# Altium schematic sheet MainBoard.SchDoc: Epic Plus
size C; Author: Thomas Schmid; CompanyName: UCLA NESL; PageSetup: Record=PageOptions|CenterHorizontal=True|CenterVertical=True|PrintScale=1.40|XCorrection=1.00|YCorrection=1.00|PrintKind=1|BorderSize=5000000|LeftOffset=0|BottomOffset=0|Orientation=2|PaperLength=5588|PaperWidth=4318|Scale=100|PaperSource=7|PrintQuality=-4|MediaType=1|DitherType=10|PaperKind=ANSI C|PrintScaleMode=1
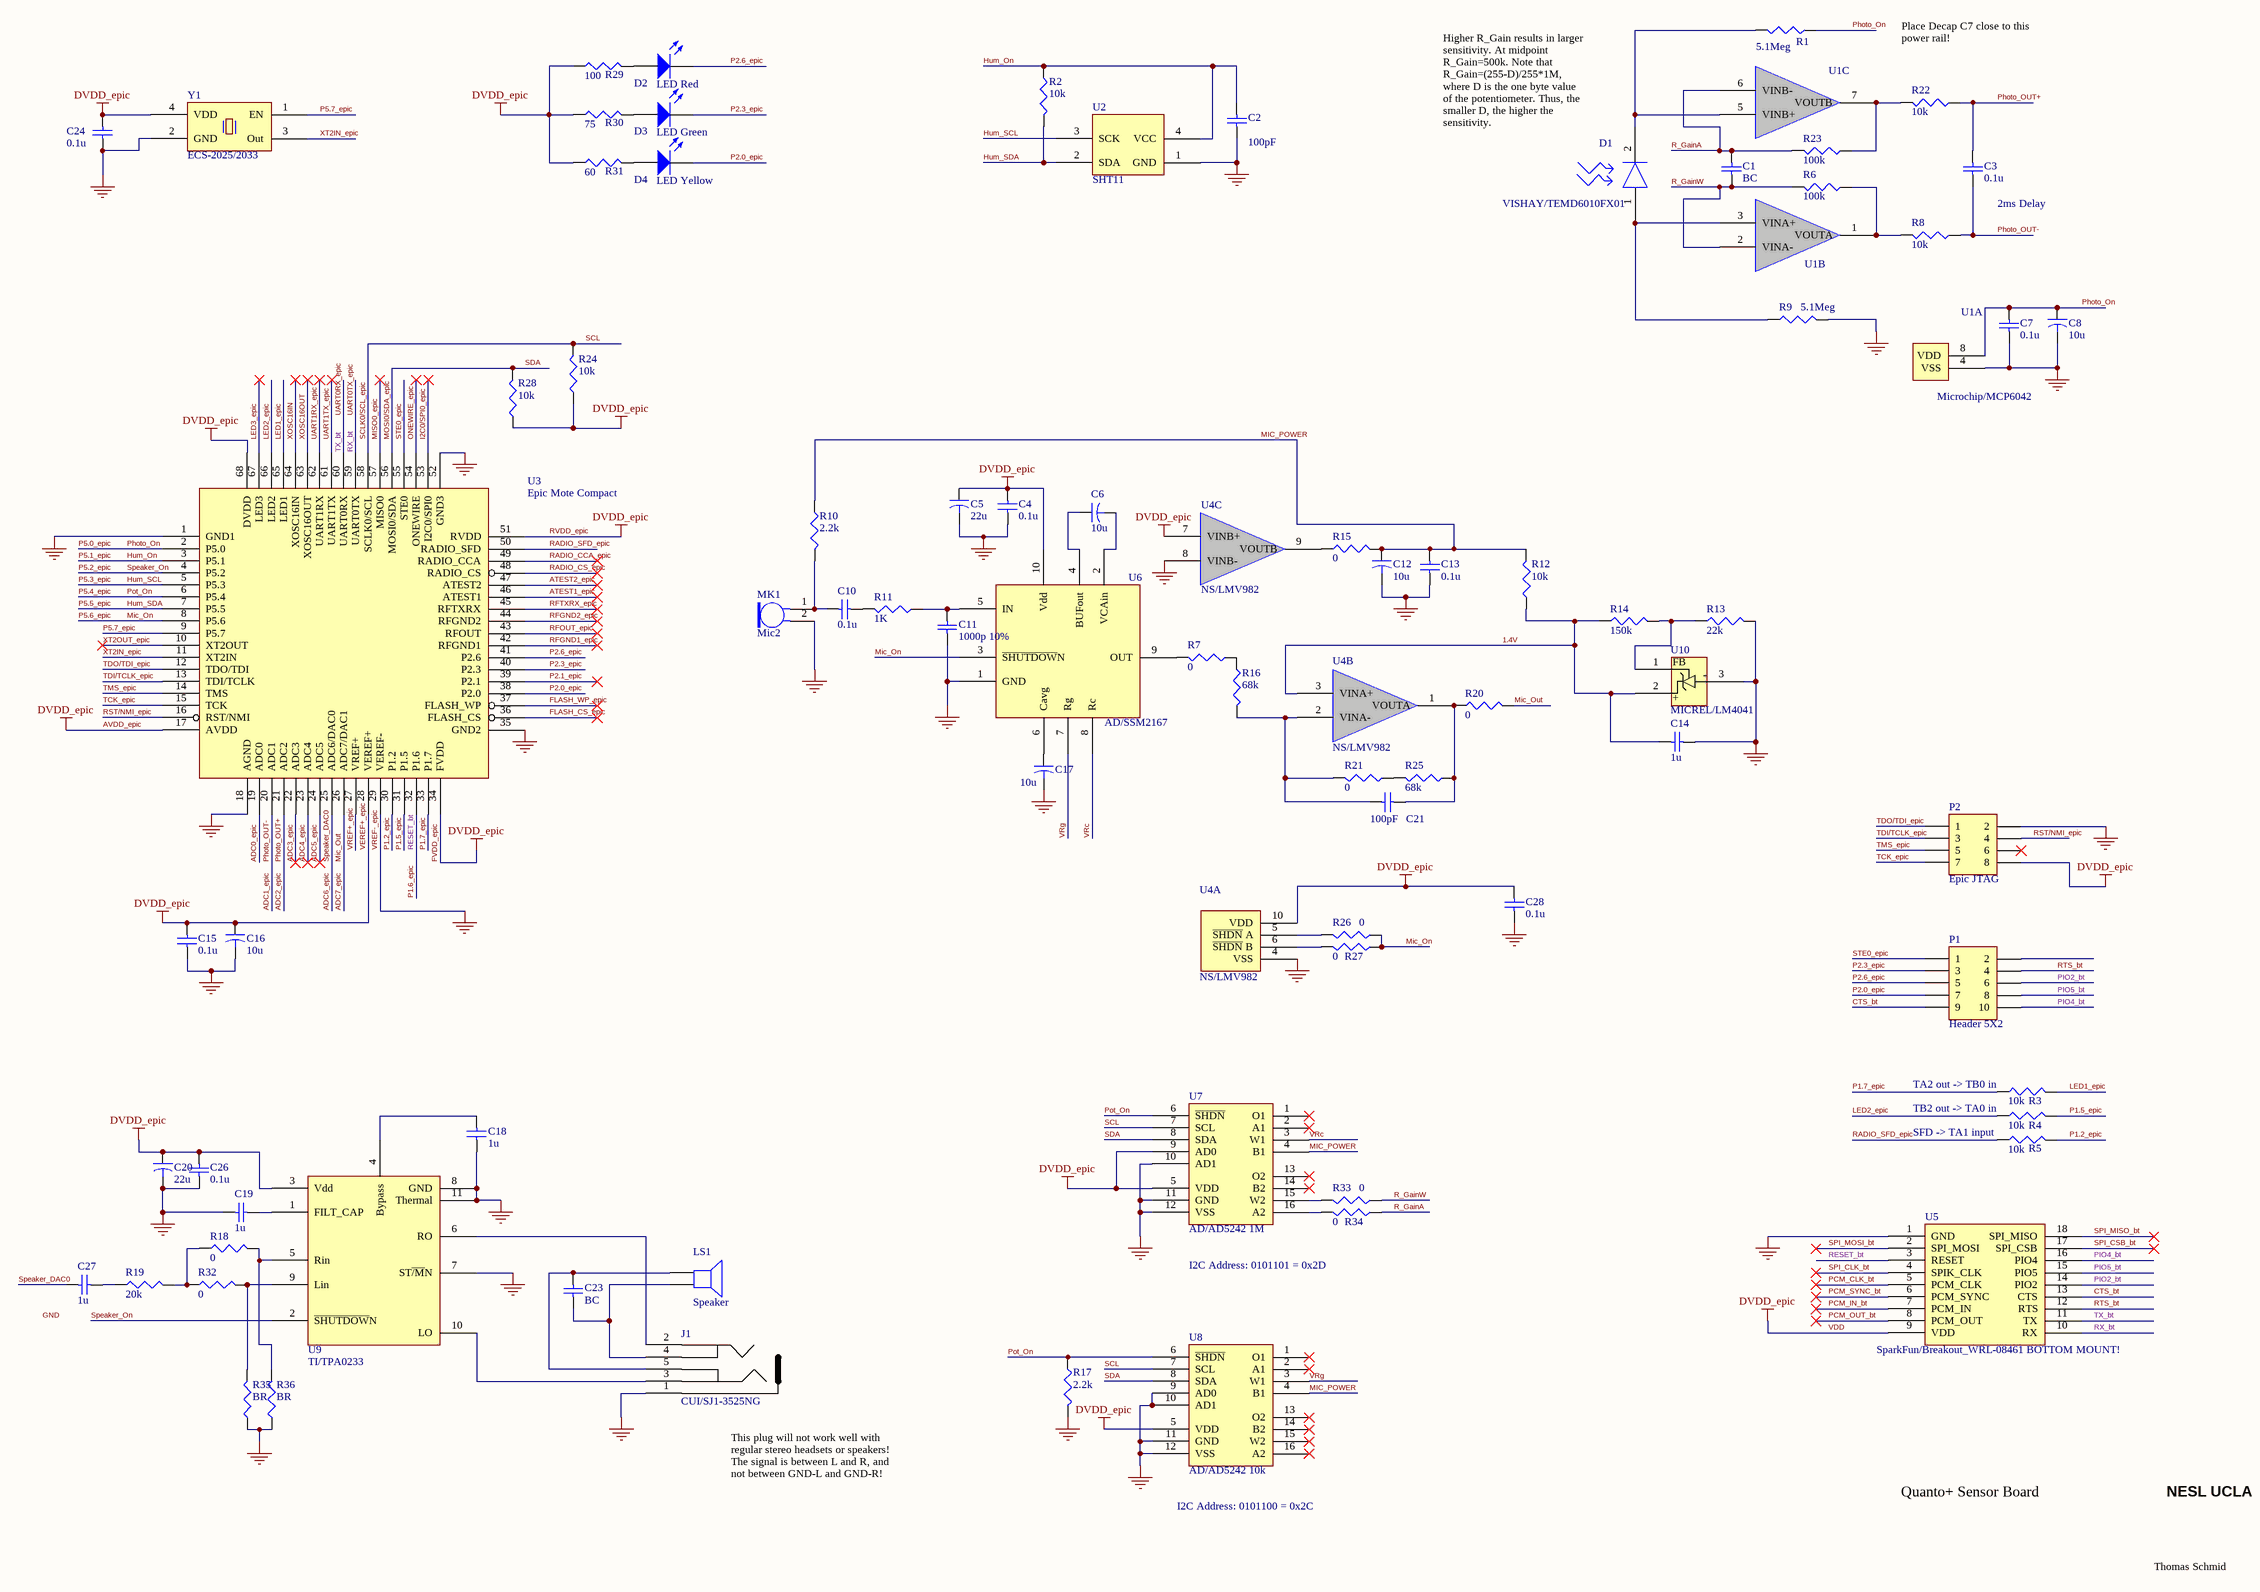
[diagram p0: MainBoard.SchDoc]

## Parts
C1  value BC  [CC1608-0603]  (hidden comment: Cap)
C2  value 100pF  [CC1608-0603]  (hidden comment: Cap)
C3  value 0.1u  [CC1608-0603]  (hidden comment: Cap)
C4  value 0.1u  [CC1608-0603]  (hidden comment: Cap)
C5  value 22u  [CC3216-1206]  (hidden comment: Cap2)
C6  value 10u  [CC1608-0603]  (hidden comment: Cap2)
C7  value 0.1u  [CC1608-0603]  (hidden comment: Cap)
C8  value 10u  [CC1608-0603]  (hidden comment: Cap2)
C10  value 0.1u  [CC1608-0603]  (hidden comment: Cap)
C11  value 1000p 10%  [CC1608-0603]  (hidden comment: Cap)
C12  value 10u  [CC1608-0603]  (hidden comment: Cap2)
C13  value 0.1u  [CC1608-0603]  (hidden comment: Cap)
C14  value 1u  [CC1608-0603]  (hidden comment: Cap)
C15  value 0.1u  [CC1608-0603]  (hidden comment: Cap)
C16  value 10u  [CC1608-0603]  (hidden comment: Cap2)
C17  value 10u  [CC1608-0603]  (hidden comment: Cap2)
C18  value 1u  [CC1608-0603]  (hidden comment: Cap)
C19  value 1u  [CC1608-0603]  (hidden comment: Cap)
C20  value 22u  [CC3216-1206]  (hidden comment: Cap2)
C21  value 100pF  [CC1608-0603]  (hidden comment: Cap)
C23  value BC  [CC1608-0603]  (hidden comment: Cap)
C24  value 0.1u  [CC1608-0603]  (hidden comment: Cap)
C26  value 0.1u  [CC1608-0603]  (hidden comment: Cap)
C27  value 1u  [CC1608-0603]  (hidden comment: Cap)
C28  value 0.1u  [CC1608-0603]  (hidden comment: Cap)
D1  VISHAY/TEMD6010FX01  [VISHAY/TEMD6010FX01]
D2  LED Red  [LiteOn/LTST-C150]
D3  LED Green  [LiteOn/LTST-C150]
D4  LED Yellow  [LiteOn/LTST-C150]
J1  CUI/SJ1-3525NG  [CUI/PHONE_JACK_3.5mm]
LS1  Speaker  [PIN2]
MK1  Mic2  [CUIINC/CMA-4544PF-W]
P1  Header 5X2  [HDR2X5]
P2  Epic JTAG  [Thomas/Header 2x4 2mm]
R1  value 5.1Meg  [CR1608-0603]  (hidden comment: Res3)
R2  value 10k  [CR1608-0603]  (hidden comment: Res3)
R3  value 10k  [CR1608-0603]  (hidden comment: Res3)
R4  value 10k  [CR1608-0603]  (hidden comment: Res3)
R5  value 10k  [CR1608-0603]  (hidden comment: Res3)
R6  value 100k  [CR1608-0603]  (hidden comment: Res3)
R7  value 0  [CR1608-0603]  (hidden comment: Res3)
R8  value 10k  [CR1608-0603]  (hidden comment: Res3)
R9  value 5.1Meg  [CR1608-0603]  (hidden comment: Res3)
R10  value 2.2k  [CR1608-0603]  (hidden comment: Res3)
R11  value 1K  [CR1608-0603]  (hidden comment: Res3)
R12  value 10k  [CR1608-0603]  (hidden comment: Res3)
R13  value 22k  [CR1608-0603]  (hidden comment: Res3)
R14  value 150k  [CR1608-0603]  (hidden comment: Res3)
R15  value 0  [CR1608-0603]  (hidden comment: Res3)
R16  value 68k  [CR1608-0603]  (hidden comment: Res3)
R17  value 2.2k  [CR1608-0603]  (hidden comment: Res3)
R18  value 0  [CR1608-0603]  (hidden comment: Res3)
R19  value 20k  [CR1608-0603]  (hidden comment: Res3)
R20  value 0  [CR1608-0603]  (hidden comment: Res3)
R21  value 0  [CR1608-0603]  (hidden comment: Res3)
R22  value 10k  [CR1608-0603]  (hidden comment: Res3)
R23  value 100k  [CR1608-0603]  (hidden comment: Res3)
R24  value 10k  [CR1608-0603]  (hidden comment: Res3)
R25  value 68k  [CR1608-0603]  (hidden comment: Res3)
R26  value 0  [CR1608-0603]  (hidden comment: Res3)
R27  value 0  [CR1608-0603]  (hidden comment: Res3)
R28  value 10k  [CR1608-0603]  (hidden comment: Res3)
R29  value 100  [CR1608-0603]  (hidden comment: Res3)
R30  value 75  [CR1608-0603]  (hidden comment: Res3)
R31  value 60  [CR1608-0603]  (hidden comment: Res3)
R32  value 0  [CR1608-0603]  (hidden comment: Res3)
R33  value 0  [CR1608-0603]  (hidden comment: Res3)
R34  value 0  [CR1608-0603]  (hidden comment: Res3)
R35  value BR  [CR1608-0603]  (hidden comment: Res3)
R36  value BR  [CR1608-0603]  (hidden comment: Res3)
U1  Microchip/MCP6042  [SOIC127P600X175-8N]  (parts A,B,C of 3)
U2  SHT11  [Sensirion/SHT11]
U3  Epic Mote Compact  [UCB/Epic_Quanto_Header]
U4  NS/LMV982  [MSOP10]  (parts A,B,C of 3)
U5  SparkFun/Breakout_WRL-08461 BOTTOM MOUNT!  [SparkFun/Breakout_WRL-084]
U6  AD/SSM2167  [MSOP127P600-8N]
U7  AD/AD5242 1M  [SOIC127P600X175-16N]
U8  AD/AD5242 10k  [SOIC127P600X175-16N]
U9  TI/TPA0233  [TSSOP50P480X107_HS-10N]
U10  MICREL/LM4041  [SOT231 (M3)]
Y1  ECS-2025/2033  [ECS_2025/2033]

## Nets
AVDD_epic: C4.1 C5.1 C15.1 C16.1 C20.1 C24.1 C26.1 C28.1 P2.8 R24.1 R28.1 R29.1 R30.1 R31.1 U3.17(AVDD) U3.28(VEREF+) U3.34(FVDD) U3.51(RVDD) U3.68(DVDD) U4.7(VINB+) U4.10(VDD) U5.9(VDD) U6.10(Vdd) U7.5(VDD) U7.9(AD0) U8.5(VDD) U9.3(Vdd) Y1.4(VDD)  [also labelled DVDD_epic, FVDD_epic, RVDD_epic, VDD, VEREF+_epic]
VREF-_epic: C2.1 C4.2 C5.2 C7.2 C8.2 C11.2 C12.2 C13.2 C14.2 C15.2 C16.2 C17.2 C18.2 C19.1 C20.2 C24.2 C26.2 C28.2 J1.1 MK1.2 P2.2 R9.2 R13.2 R17.2 R35.1 R36.1 U1.4(VSS) U2.1(GND) U3.1(GND1) U3.18(AGND) U3.29(VEREF-) U3.35(GND2) U3.52(GND3) U4.4(VSS) U4.8(VINB-) U5.1(GND) U6.1(GND) U7.10(AD1) U7.11(GND) U7.12(VSS) U8.9(AD0) U8.10(AD1) U8.11(GND) U8.12(VSS) U9.7(ST~{/M}N) U9.8(GND) U9.11(Thermal) U10.3(-) Y1.2(GND)  [also labelled GND]
1.4V: C14.1 R12.1 R14.1 U4.3(VINA+) U10.2
ADC0_epic: U3.19(ADC0)
ADC1_epic: C3.2 R8.1 U3.20(ADC1)  [also labelled Photo_OUT-]
ADC2_epic: C3.1 R22.1 U3.21(ADC2)  [also labelled Photo_OUT+]
ADC3_epic: U3.22(ADC3)
ADC4_epic: U3.23(ADC4)
ADC5_epic: U3.24(ADC5)
ADC6_epic: C27.2 U3.25(ADC6/DAC0)  [also labelled Speaker_DAC0]
ADC7_epic: R20.2 U3.26(ADC7/DAC1)  [also labelled Mic_Out]
ATEST1_epic: U3.46(ATEST1)
ATEST2_epic: U3.47(ATEST2)
CTS_bt: P1.9 U5.13(CTS)
FLASH_CS_epic: U3.36(FLASH_CS)
FLASH_WP_epic: U3.37(FLASH_WP)
Hum_On: C2.2 R2.1 U2.4(VCC) U3.3(P5.1)  [also labelled P5.1_epic]
Hum_SCL: U2.3(SCK) U3.5(P5.3)  [also labelled P5.3_epic]
Hum_SDA: R2.2 U2.2(SDA) U3.7(P5.5)  [also labelled P5.5_epic]
I2C0/SPI0_epic: U3.53(I2C0/SPI0)
LED1_epic: R3.2 U3.65(LED1)
LED2_epic: R4.1 U3.66(LED2)
LED3_epic: U3.67(LED3)
Mic_On: R26.2 R27.2 U3.8(P5.6) U6.3(~{SHUTDOW}N)  [also labelled P5.6_epic]
MIC_POWER: C12.1 C13.1 R10.1 R12.2 R15.2 U7.4(B1) U8.4(B1)
MISO0_epic: U3.57(MISO0)
MOSI0/SDA_epic: R28.2 U3.56(MOSI0/SDA) U7.8(SDA) U8.8(SDA)  [also labelled SDA]
ONEWIRE_epic: U3.54(ONEWIRE)
P1.2_epic: R5.2 U3.30(P1.2)
P1.5_epic: R4.2 U3.31(P1.5)
P1.6_epic: U3.32(P1.6) U5.3(RESET)  [also labelled RESET_bt]
P1.7_epic: R3.1 U3.33(P1.7)
P2.0_epic: D4.2(K) P1.7 U3.38(P2.0)
P2.1_epic: U3.39(P2.1)
P2.3_epic: D3.2(K) P1.3 U3.40(P2.3)
P2.6_epic: D2.2(K) P1.5 U3.41(P2.6)
P5.0_epic: C7.1 C8.1 R1.2 U1.8(VDD) U3.2(P5.0)  [also labelled Photo_On]
P5.2_epic: U3.4(P5.2) U9.2(~{SHUTDOW}N)  [also labelled Speaker_On]
P5.4_epic: R17.1 U3.6(P5.4) U7.6(~{SHDN}) U8.6(~{SHDN})  [also labelled Pot_On]
P5.7_epic: U3.9(P5.7) Y1.1(EN)
PCM_CLK_bt: U5.5(PCM_CLK)
PCM_IN_bt: U5.7(PCM_IN)
PCM_OUT_bt: U5.8(PCM_OUT)
PCM_SYNC_bt: U5.6(PCM_SYNC)
PIO2_bt: P1.6 U5.14(PIO2)
PIO4_bt: P1.10 U5.16(PIO4)
PIO5_bt: P1.8 U5.15(PIO5)
R_GainA: C1.1 R23.2 R34.2 U1.6(VINB-)
R_GainW: C1.2 R6.2 R33.2 U1.2(VINA-)
RADIO_CCA_epic: U3.49(RADIO_CCA)
RADIO_CS_epic: U3.48(RADIO_CS)
RADIO_SFD_epic: R5.1 U3.50(RADIO_SFD)
RFGND1_epic: U3.42(RFGND1)
RFGND2_epic: U3.44(RFGND2)
RFOUT_epic: U3.43(RFOUT)
RFTXRX_epic: U3.45(RFTXRX)
RST/NMI_epic: P2.4 U3.16(RST/NMI)
RTS_bt: P1.4 U5.12(RTS)
RX_bt: U3.59(UART0TX) U5.10(RX)  [also labelled UART0TX_epic]
SCL: R24.2 U3.58(SCLK0/SCL) U7.7(SCL) U8.7(SCL)  [also labelled SCLK0/SCL_epic]
SPI_CLK_bt: U5.4(SPIK_CLK)
SPI_CSB_bt: U5.17(SPI_CSB)
SPI_MISO_bt: U5.18(SPI_MISO)
SPI_MOSI_bt: U5.2(SPI_MOSI)
STE0_epic: P1.1 U3.55(STE0)
TCK_epic: P2.7 U3.15(TCK)
TDI/TCLK_epic: P2.3 U3.13(TDI/TCLK)
TDO/TDI_epic: P2.1 U3.12(TDO/TDI)
TMS_epic: P2.5 U3.14(TMS)
TX_bt: U3.60(UART0RX) U5.11(TX)  [also labelled UART0RX_epic]
UART1RX_epic: U3.62(UART1RX)
UART1TX_epic: U3.61(UART1TX)
VRc: U6.8(Rc) U7.3(W1)
VREF+_epic: U3.27(VREF+)
VRg: U6.7(Rg) U8.3(W1)
XOSC16IN: U3.64(XOSC16IN)
XOSC16OUT: U3.63(XOSC16OUT)
XT2IN_epic: U3.11(XT2IN) Y1.3(Out)
XT2OUT_epic: U3.10(XT2OUT)
NetC6_1: C6.1 U6.4(BUFout)
NetC6_2: C6.2 U6.2(VCAin)
NetC10_1: C10.1 R11.2
NetC10_2: C10.2 MK1.1 R10.2
NetC11_1: C11.1 R11.1 U6.5(IN)
NetC17_1: C17.1 U6.6(Cavg)
NetC18_1: C18.1 U9.4(Bypass)
NetC19_2: C19.2 U9.1(FILT_CAP)
NetC21_1: C21.1 R20.1 R25.2 U4.1(VOUTA)
NetC21_2: C21.2 R16.1 R21.1 U4.2(VINA-)
NetC23_1: C23.1 J1.5 LS1.1
NetC23_2: C23.2 J1.4 LS1.2
NetC27_1: C27.1 R19.1
NetD1_1: D1.1 R9.1 U1.3(VINA+)
NetD1_2: D1.2 R1.1 U1.5(VINB+)
NetD2_1: D2.1(A) R29.2
NetD3_1: D3.1(A) R30.2
NetD4_1: D4.1(A) R31.2
NetJ1_2: J1.2 U9.6(RO)
NetJ1_3: J1.3 U9.10(LO)
NetR6_1: R6.1 R8.2 U1.1(VOUTA)
NetR7_1: R7.1 U6.9(OUT)
NetR7_2: R7.2 R16.2
NetR13_1: R13.1 R14.2 U10.1
NetR15_1: R15.1 U4.9(VOUTB)
NetR18_1: R18.1 R19.2 R32.1
NetR18_2: R18.2 R36.2 U9.5(Rin)
NetR21_2: R21.2 R25.1
NetR22_2: R22.2 R23.1 U1.7(VOUTB)
NetR26_1: R26.1 U4.5(~{SHDN}_A)
NetR27_1: R27.1 U4.6(~{SHDN}_B)
NetR32_2: R32.2 R35.2 U9.9(Lin)
NetR33_1: R33.1 U7.15(W2)
NetR34_1: R34.1 U7.16(A2)

Not connected (* = marked no-connect by the designer): P1 2; P2 6*; U7 1(O1)* 2(A1)* 13(O2)* 14(B2)*; U8 1(O1)* 2(A1)* 13(O2)* 14(B2)* 15(W2)* 16(A2)*

## Notes on the sheet
- Place Decap C7 close to this power rail!
- Higher R_Gain results in larger sensitivity. At midpoint R_Gain=500k. Note that R_Gain=(255-D)/255*1M, where D is the one byte value of the potentiometer. Thus, the smaller D, the higher the sensitivity.
- 2ms Delay
- (near R3) TA2 out -> TB0 in
- SFD -> TA1 input
- (near R4) TB2 out -> TA0 in
- I2C Address: 0101101 = 0x2D
- This plug will not work well with regular stereo headsets or speakers! The signal is between L and R, and not between GND-L and GND-R!
- I2C Address: 0101100 = 0x2C
- Quanto+ Sensor Board
- NESL UCLA
- Thomas Schmid
- Labels drawn without touching a wire or pin: GND
- (in symbol MICREL/LM4041) FB; +

## Library data of the parts
C1-C4 C7 C10 C11 C13-C15 C18 C19 C21 C23 C24 C26-C28 = Cap: Capacitor; Published: 8-Jun-2000; LatestRevisionDate: 17-Jul-2002; LatestRevisionNote: Re-released for DXP Platform.; PackageReference: RAD-0.3; Publisher: Altium Limited
C5 C6 C8 C12 C16 C17 C20 = Cap2: Capacitor; Published: 23-Sep-2002; PackageReference: CAPR5-4X5; Publisher: Altium Limited
D2-D4 = LED2: Typical RED, GREEN, YELLOW, AMBER GaAs LED; Published: 8-Jun-2000; LatestRevisionDate: 17-Jul-2002; LatestRevisionNote: Re-released for DXP Platform.; PackageDocument: Feb-2002; PackageReference: 3.2X1.6X1.1; Publisher: Altium Limited
  D2: Value: Red
  D3: Value: Green
  D4: Value: Yellow
LS1 = Speaker: Loudspeaker; Published: 24-Mar-1999; LatestRevisionDate: 17-Jul-2002; LatestRevisionNote: Re-released for DXP Platform.; PackageReference: PIN2; Publisher: Altium Limited
MK1 = Mic2: Microphone; Published: 24-Mar-1999; LatestRevisionDate: 17-Jul-2002; LatestRevisionNote: Re-released for DXP Platform.; PackageReference: PIN2; Publisher: Altium Limited
P1 = Header 5X2: Header, 5-Pin, Dual row; LatestRevisionDate: 17-Jul-2002; LatestRevisionNote: Re-released for DXP Platform.; Publisher: Altium Limited
P2 = Header 4X2: Header, 4-Pin, Dual row; LatestRevisionDate: 17-Jul-2002; LatestRevisionNote: Re-released for DXP Platform.; Publisher: Altium Limited
R1-R36 = Res3: Resistor; Published: 8-Jun-2000; LatestRevisionDate: 04-Mar-2005; LatestRevisionNote: PCB Footprint replaced.; PackageReference: J1-0603; Publisher: Altium Limited
U5 = SparkFun/Breakout_WRL-084
U7 U8 = AD/AD5242
  U7: Value: 1M
  U8: Value: 10k